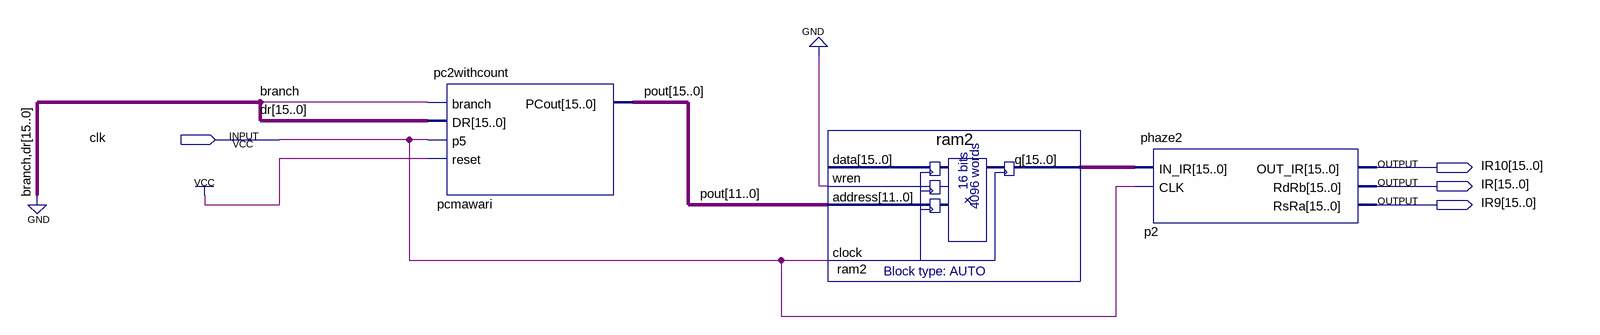
[diagram p0: schematic sheet]
// Quartus schematic jikken.bdf as structural Verilog: 3 symbols, 4 pins
module jikken (
  input  clk,
  output [15:0] IR10,
  output [15:0] IR,
  output [15:0] IR9
);

  wire [15:0] pout, ram2_q;

  pc2withcount pcmawari (.branch(1'b0), .DR({16{1'b0}}), .p5(clk), .reset(1'b1), .PCout(pout));
  ram2 ram2 (.wren(1'b0), .address(pout[11:0]), .clock(clk), .q(ram2_q));  // open: data
  phaze2 p2 (.IN_IR(ram2_q), .CLK(clk), .OUT_IR(IR10), .RdRb(IR), .RsRa(IR9));
endmodule
